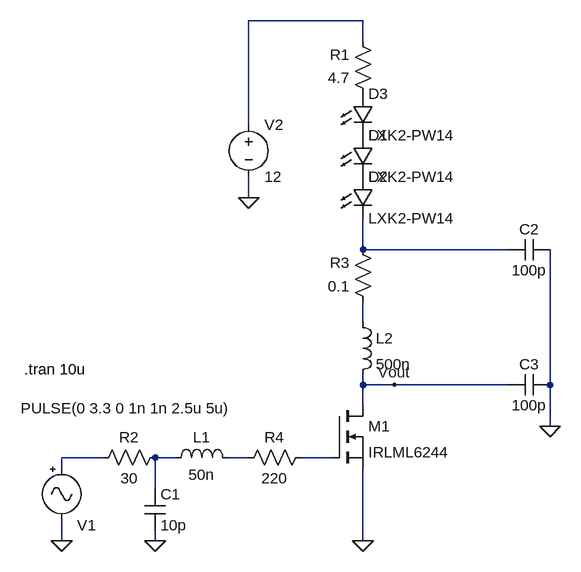
[diagram p0: schematic overshoot_simulation.asc]
overshoot_simulation.asc, the LTspice schematic file:
Version 4
SHEET 1 880 680
WIRE 368 -448 192 -448
WIRE 368 -416 368 -448
WIRE 192 -288 192 -448
WIRE 192 -176 192 -208
WIRE 368 -96 368 -144
WIRE 592 -96 368 -96
WIRE 368 16 368 -16
WIRE 368 112 368 96
WIRE 416 112 368 112
WIRE 592 112 416 112
WIRE 656 112 656 -96
WIRE 368 144 368 112
WIRE 656 176 656 112
WIRE -32 224 -96 224
WIRE 80 224 48 224
WIRE 192 224 160 224
WIRE 320 224 272 224
WIRE -96 240 -96 224
WIRE 48 272 48 224
WIRE -96 352 -96 320
WIRE 48 352 48 336
WIRE 368 352 368 240
FLAG 368 352 0
FLAG -96 352 0
FLAG 48 352 0
FLAG 192 -176 0
FLAG 656 176 0
FLAG 416 112 Vout
SYMBOL res 64 208 R90
WINDOW 0 0 56 VBottom 2
WINDOW 3 32 56 VTop 2
SYMATTR InstName R2
SYMATTR Value 30
SYMBOL ind 64 240 R270
WINDOW 0 32 56 VTop 2
WINDOW 3 5 56 VBottom 2
SYMATTR InstName L1
SYMATTR Value 50n
SYMBOL Misc\\signal -96 224 R0
WINDOW 0 24 104 Left 2
WINDOW 3 -63 -76 Left 2
WINDOW 123 0 0 Left 2
WINDOW 39 0 0 Left 2
SYMATTR InstName V1
SYMATTR Value PULSE(0 3.3 0 1n 1n 2.5u 5u)
SYMBOL cap 32 272 R0
SYMATTR InstName C1
SYMATTR Value 10p
SYMBOL nmos 320 144 R0
SYMATTR InstName M1
SYMATTR Value IRLML6244
SYMBOL voltage 192 -304 R0
WINDOW 123 0 0 Left 2
WINDOW 39 0 0 Left 2
SYMATTR InstName V2
SYMATTR Value 12
SYMBOL LED 352 -336 R0
SYMATTR InstName D3
SYMATTR Value LXK2-PW14
SYMBOL res 384 -320 R180
WINDOW 0 36 76 Left 2
WINDOW 3 36 40 Left 2
SYMATTR InstName R1
SYMATTR Value 4.7
SYMBOL ind 352 0 R0
SYMATTR InstName L2
SYMATTR Value 500n
SYMBOL LED 352 -272 R0
SYMATTR InstName D1
SYMATTR Value LXK2-PW14
SYMBOL LED 352 -208 R0
SYMATTR InstName D2
SYMATTR Value LXK2-PW14
SYMBOL cap 656 -112 R90
WINDOW 0 0 32 VBottom 2
WINDOW 3 32 32 VTop 2
SYMATTR InstName C2
SYMATTR Value 100p
SYMBOL cap 656 96 R90
WINDOW 0 0 32 VBottom 2
WINDOW 3 32 32 VTop 2
SYMATTR InstName C3
SYMATTR Value 100p
SYMBOL res 384 0 R180
WINDOW 0 36 76 Left 2
WINDOW 3 36 40 Left 2
SYMATTR InstName R3
SYMATTR Value 0.1
SYMBOL res 288 208 R90
WINDOW 0 0 56 VBottom 2
WINDOW 3 32 56 VTop 2
SYMATTR InstName R4
SYMATTR Value 220
TEXT -154 88 Left 2 !.tran 10u

The netlist it stands for:
* overshoot_simulation.asc
R2 N005 N004 30
L1 N005 N006 50n
V1 N004 0 PULSE(0 3.3 0 1n 1n 2.5u 5u)
C1 N005 0 10p
M1 Vout N007 0 0 IRLML6244
V2 N001 0 12
D3 P001 P002 LXK2-PW14
R1 P001 N001 4.7
L2 N003 Vout 500n
D1 P002 P003 LXK2-PW14
D2 P003 N002 LXK2-PW14
C2 0 N002 100p
C3 0 Vout 100p
R3 N003 N002 0.1
R4 N007 N006 220
.model D D
.lib standard.dio
.model NMOS NMOS
.model PMOS PMOS
.lib standard.mos
.tran 10u
.backanno
.end